# EAGLE design IDS_ADC_SMT (EAGLE 9.5.0)
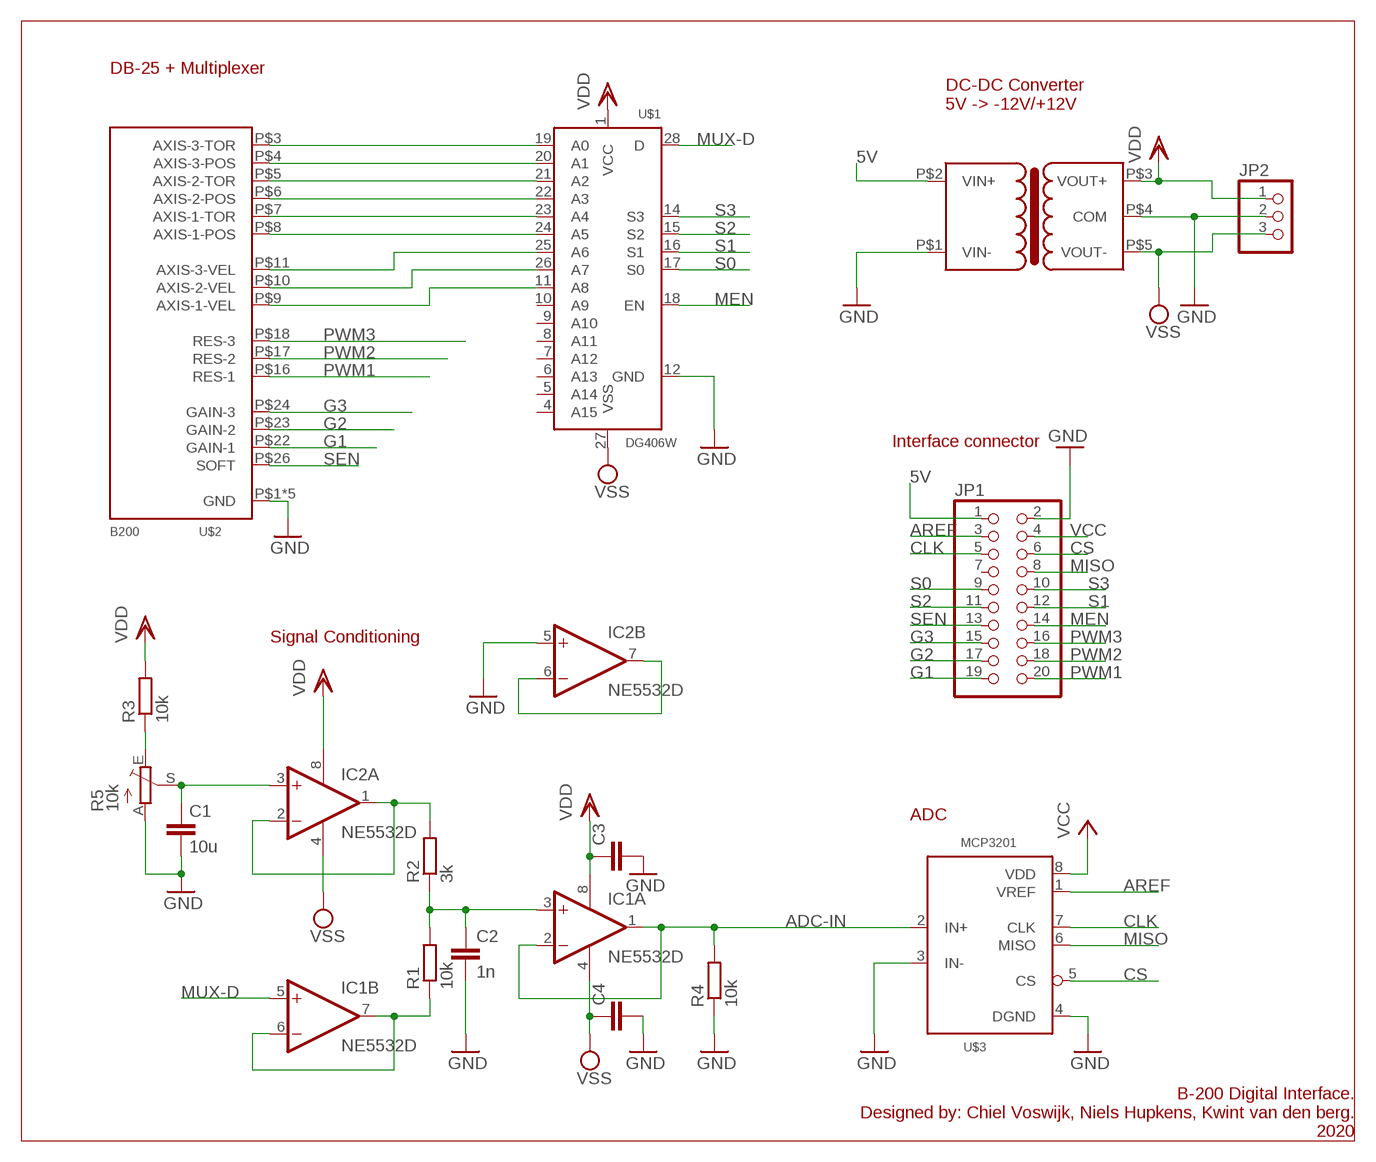
[diagram p0: schematic, sheet 1]

## Parts
C1  10u  C-EUC1210  [C1210]
C2  1n  C-EUC0805  [C0805]
C3  C-EUC0805  [C0805]
C4  C-EUC0805  [C0805]
IC1  NE5532D  [SO08]
IC2  NE5532D  [SO08]
JP1  PINHD-2X10  [2X10]
JP2  PINHD-1X3  [1X03]
R1  10k  R-EU_R0805  [R0805]
R2  3k  R-EU_R0805  [R0805]
R3  10k  R-EU_R0805  [R0805]
R4  10k  R-EU_R0805  [R0805]
R5  10k  TRIM_EU-RJ9W  [RJ9W]
U$1  DG406W  [SO-28W]
U$2  B200  [PARALLEL]
U$3  MCP3201  [DIL08]
U$4  TRACO-DR-NE  [TRACO-DCDC-SIP6]

## Nets
5V: JP1.1 U$4.P$2(VIN+)
ADC-IN: IC1.1(A:OUT) IC1.2(A:-IN) R4.2 U$3.2(IN+)
AREF: JP1.3 U$3.1(VREF)
CLK: JP1.5 U$3.7(CLK)
CS: JP1.6 U$3.5(CS)
G1: JP1.19 U$2.P$22(GAIN-1)
G2: JP1.17 U$2.P$23(GAIN-2)
G3: JP1.15 U$2.P$24(GAIN-3)
GND: C1.2 C2.2 C3.2 C4.2 IC2.5(B:+IN) JP1.2 JP2.2 R4.1 R5.A U$1.12(GND) U$2.P$1(GND) U$2.P$2(GND) U$2.P$19(GND) U$2.P$20(GND) U$2.P$21(GND) U$3.3(IN-) U$3.4(DGND) U$4.P$1(VIN-) U$4.P$4(COM)
MEN: JP1.14 U$1.18(EN)
MISO: JP1.8 U$3.6(MISO)
MUX-D: IC1.5(B:+IN) U$1.28(D)
N$1: IC2.6(B:-IN) IC2.7(B:OUT)
N$2: U$1.19(A0) U$2.P$3(AXIS-3-TOR)
N$3: C2.1 IC1.3(A:+IN) R1.2 R2.1
N$4: U$1.20(A1) U$2.P$4(AXIS-3-POS)
N$5: IC1.6(B:-IN) IC1.7(B:OUT) R1.1
N$6: U$1.21(A2) U$2.P$5(AXIS-2-TOR)
N$7: IC2.1(A:OUT) IC2.2(A:-IN) R2.2
N$8: C1.1 IC2.3(A:+IN) R5.S
N$9: U$1.22(A3) U$2.P$6(AXIS-2-POS)
N$10: U$1.23(A4) U$2.P$7(AXIS-1-TOR)
N$11: U$1.24(A5) U$2.P$8(AXIS-1-POS)
N$12: U$1.25(A6) U$2.P$11(AXIS-3-VEL)
N$13: U$1.26(A7) U$2.P$10(AXIS-2-VEL)
N$14: U$1.11(A8) U$2.P$9(AXIS-1-VEL)
N$15: R3.1 R5.E
PWM1: JP1.20 U$2.P$16(RES-1)
PWM2: JP1.18 U$2.P$17(RES-2)
PWM3: JP1.16 U$2.P$18(RES-3)
S0: JP1.9 U$1.17(S0)
S1: JP1.12 U$1.16(S1)
S2: JP1.11 U$1.15(S2)
S3: JP1.10 U$1.14(S3)
SEN: JP1.13 U$2.P$26(SOFT)
VCC: JP1.4 U$3.8(VDD)
VDD: C3.1 IC1.8(P:V+) IC2.8(P:V+) JP2.1 R3.2 U$1.1(VCC) U$4.P$3(VOUT+)
VSS: C4.1 IC1.4(P:V-) IC2.4(P:V-) JP2.3 U$1.27(VSS) U$4.P$5(VOUT-)
Unconnected: JP1.7 U$1.4(A15) U$1.5(A14) U$1.6(A13) U$1.7(A12) U$1.8(A11) U$1.9(A10) U$1.10(A9)

## Notes on the sheet
- DB-25 + Multiplexer
- DC-DC Converter
  5V -> -12V/+12V
- Interface connector
- Signal Conditioning
- ADC
- B-200 Digital Interface.
  Designed by: Chiel Voswijk, Niels Hupkens, Kwint van den berg.
  2020

## Library data of the parts
C1-C4 = rcl:C-EU: CAPACITOR, European symbol; SPICEPREFIX: C
IC1 IC2 = linear:NE5532: AUDIO AMPLIFIER
JP1 = pinhead:PINHD-2X10: PIN HEADER
JP2 = pinhead:PINHD-1X3: PIN HEADER
R1-R4 = rcl:R-EU_: RESISTOR, European symbol; SPICEPREFIX: R
R5 = pot:TRIM_EU-: POTENTIOMETER
U$1 = FHD-Actives:DG406: "Jellybean" DG406 Multiplexer
U$2 = FHD-Connectors:B200
U$3 = FHD-Actives:MCP3201
U$4 = FHD-POWER:TRACO-DR-NE

## Board
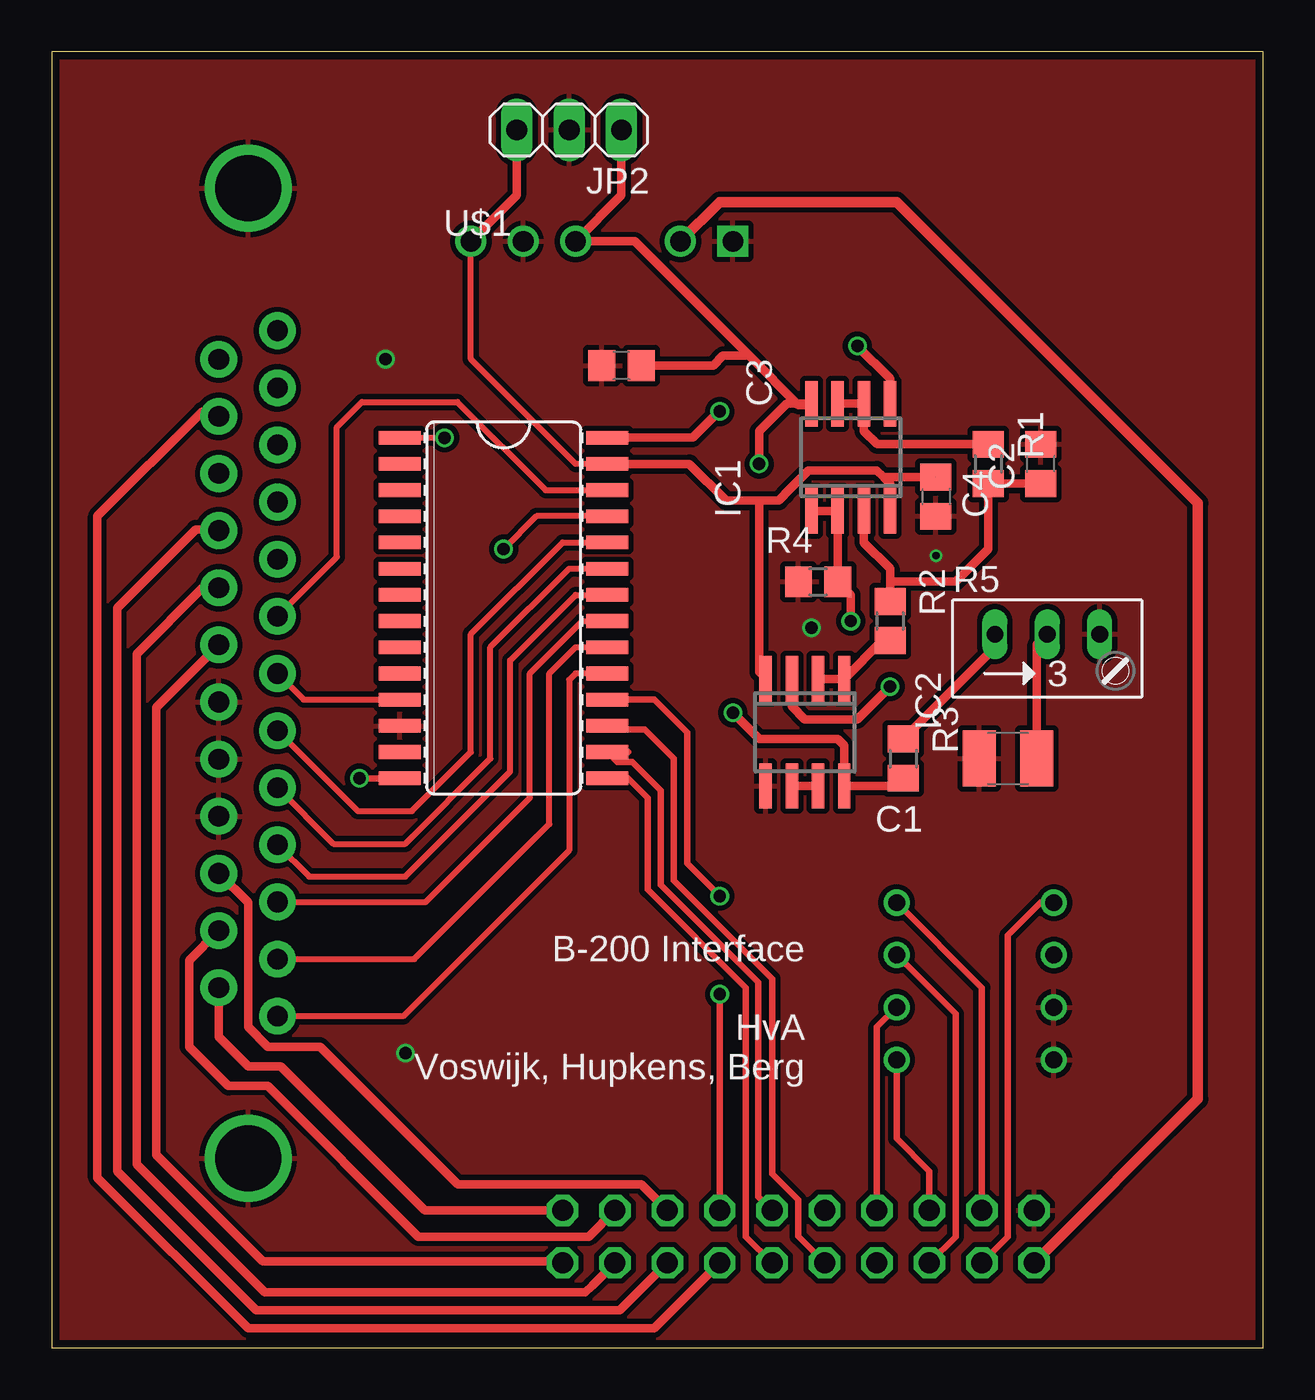
[diagram p1: board, top side]
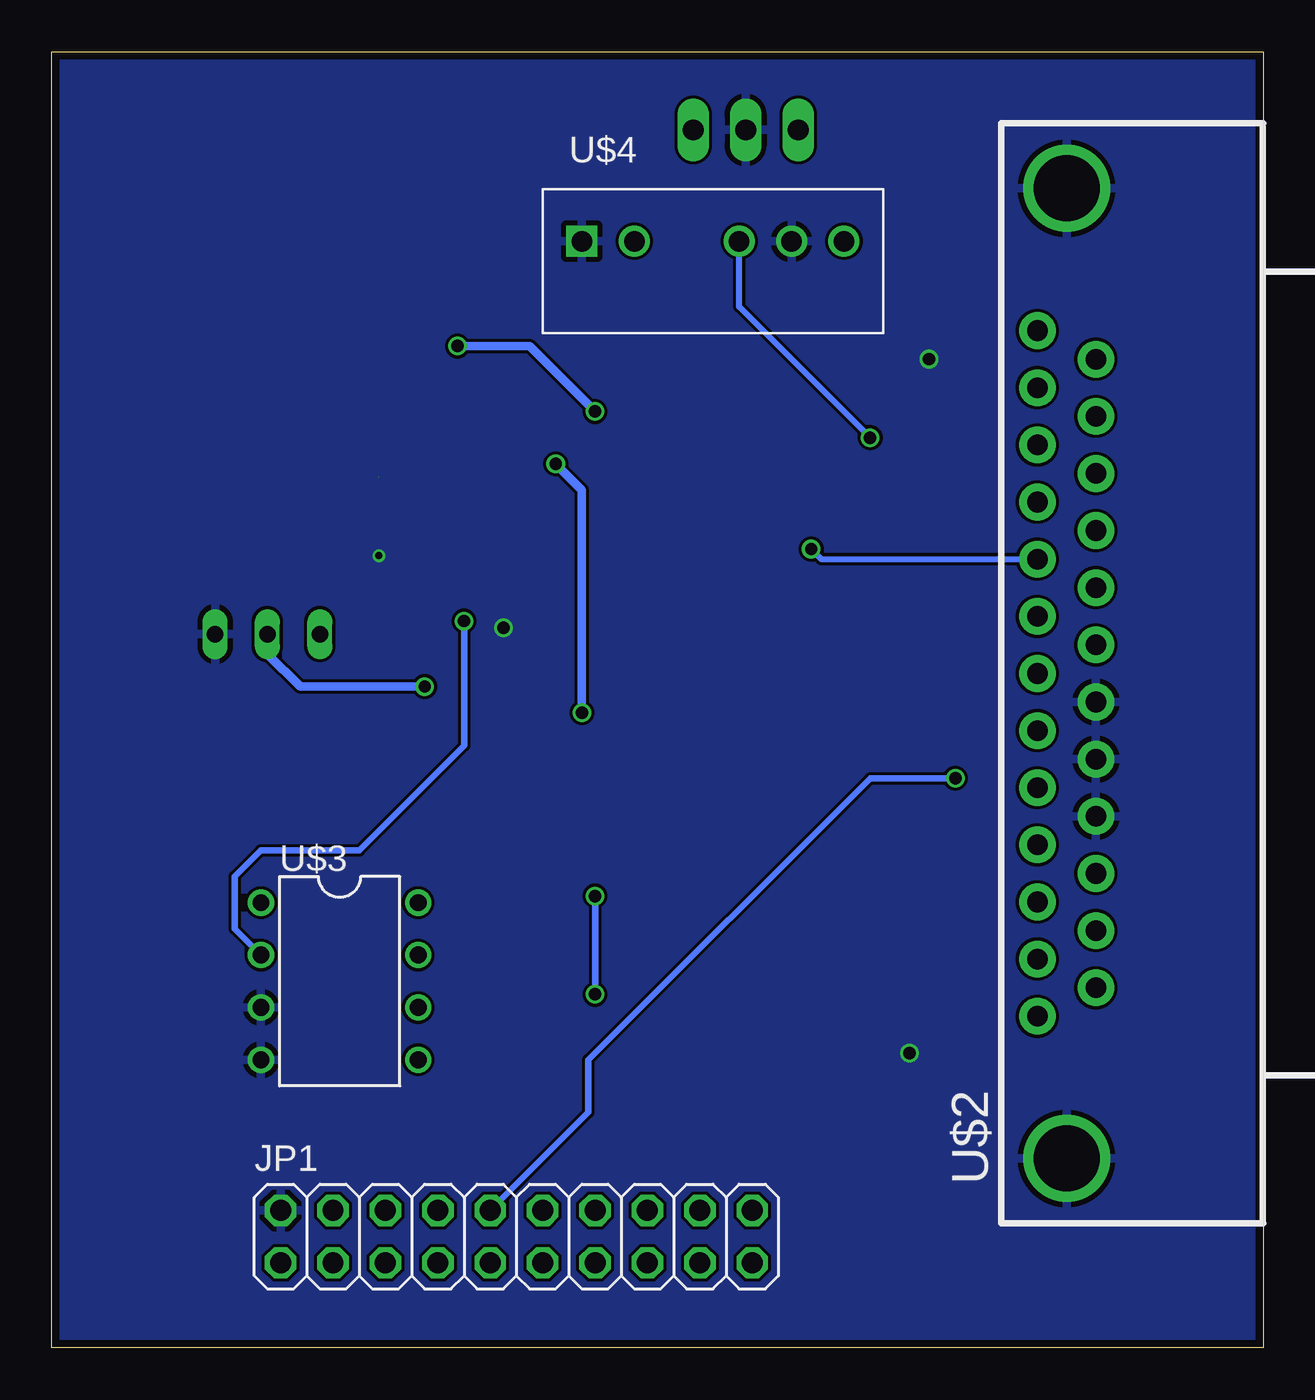
[diagram p2: board, bottom side, seen from below]

Size 58.72 x 62.85 mm. Coordinates in mm from the lower left corner, seen from the top.
Outline: 0,0 58.72,0 58.72,62.85 0,62.85 0,0
Copper layers (1*16): Top 0.035559375mm / dielectric 1.6mm / Bottom 0.035559375mm
Design rules "oshpark-2layer": minimum track width 6mil, minimum drill 10mil, track to track 6mil, track to pad 6mil, pad to pad 6mil, via to via 6mil, smd to smd 6mil, copper to edge 15mil, drill to drill 6mil, minimum pad ring 5mil, minimum via ring 5mil, stop-mask expansion 2.5mil, vias tented up to drill 0mil, thermal gap 10mil

### Footprints (pad centres in the part's own frame; a part is rotated, then mirrored left to right if it is on the bottom)
C1210 = smd 1.6 x 2.7: 1 -1.4,0; 2 1.4,0
C0805 = smd 1.3 x 1.5: 1 -0.95,0; 2 0.95,0
SO08 = smd 0.6 x 2.2: 1 -1.905,-2.6; 2 -0.635,-2.6; 3 0.635,-2.6; 4 1.905,-2.6; 5 1.905,2.6; 6 0.635,2.6; 7 -0.635,2.6; 8 -1.905,2.6
2X10 = drill 1.016 octagon: 1 -11.43,-1.27; 2 -11.43,1.27; 3 -8.89,-1.27; 4 -8.89,1.27; 5 -6.35,-1.27; 6 -6.35,1.27; 7 -3.81,-1.27; 8 -3.81,1.27; 9 -1.27,-1.27; 10 -1.27,1.27; 11 1.27,-1.27; 12 1.27,1.27; 13 3.81,-1.27; 14 3.81,1.27; 15 6.35,-1.27; 16 6.35,1.27; 17 8.89,-1.27; 18 8.89,1.27; 19 11.43,-1.27; 20 11.43,1.27
1X03 = drill 1.016 long: 1 -2.54,0; 2 0,0; 3 2.54,0
R0805 = smd 1.3 x 1.5: 1 -0.95,0; 2 0.95,0
RJ9W = drill 0.813 long: A 2.54,0.635; E -2.54,0.635; S 0,0.635
SO-28W = smd 0.66 x 2.032: 1 -8.255,-5.029; 2 -6.985,-5.029; 3 -5.715,-5.029; 4 -4.445,-5.029; 5 -3.175,-5.029; 6 -1.905,-5.029; 7 -0.635,-5.029; 8 0.635,-5.029; 9 1.905,-5.029; 10 3.175,-5.029; 11 4.445,-5.029; 12 5.715,-5.029; 13 6.985,-5.029; 14 8.255,-5.029; 15 8.255,5.029; 16 6.985,5.029; 17 5.715,5.029; 18 4.445,5.029; 19 3.175,5.029; 20 1.905,5.029; 21 0.635,5.029; 22 -0.635,5.029; 23 -1.905,5.029; 24 -3.175,5.029; 25 -4.445,5.029; 26 -5.715,5.029; 27 -6.985,5.029; 28 -8.255,5.029
PARALLEL = drill 3.2: P$1 -23.52,0; P$2 23.52,0 | drill 1 pad 1.778: P$3 -16.62,1.42; P$4 -13.85,1.42; P$5 -11.08,1.42; P$6 -8.31,1.42; P$7 -5.54,1.42; P$8 -2.77,1.42; P$9 0,1.42; P$10 2.77,1.42; P$11 5.54,1.42; P$12 8.31,1.42; P$13 11.08,1.42; P$14 13.85,1.42; P$15 16.62,1.42; P$16 -15.235,-1.42; P$17 -12.465,-1.42; P$18 -9.695,-1.42; P$19 -6.925,-1.42; P$20 -4.155,-1.42; P$21 -1.385,-1.42; P$22 1.385,-1.42; P$23 4.155,-1.42; P$24 6.925,-1.42; P$25 9.695,-1.42; P$26 12.465,-1.42; P$27 15.235,-1.42
DIL08 = drill 0.813 pad 1.27: 1 -3.81,-3.81; 2 -1.27,-3.81; 3 1.27,-3.81; 4 3.81,-3.81; 5 3.81,3.81; 6 1.27,3.81; 7 -1.27,3.81; 8 -3.81,3.81
TRACO-DCDC-SIP6 = drill 1 square: P$1 -8.89,1.27 | drill 1: P$2 -6.35,1.27; P$3 -1.27,1.27; P$4 1.27,1.27; P$5 3.81,1.27

### Placement (x,y rotation side)
C1  46.35,28.57 180 top
C2  47.94,42.86 90 top
C3  27.62,47.62 180 top
C4  42.86,41.27 270 top
IC1  38.73,43.18 0 top
IC2  36.51,29.84 180 top
JP1  36.2,5.4 0 bottom
JP2  25.08,59.05 180 top
R1  45.4,42.86 270 top
R2  40.64,35.24 270 top
R3  41.27,28.57 270 top
R4  37.15,37.15 0 top
R5  48.26,33.97 0 top
U$1  21.91,35.88 270 top
U$2  9.53,32.7 90 bottom
U$3  44.77,17.78 270 bottom
U$4  24.13,52.39 0 bottom

### Tracks (layer width: path | path; a pad name or v marks a point on that pad's centre or on a via)
5V
  Top 0.508: JP1.1 55.56,12.06 55.56,40.96 40.96,55.56 32.38,55.56 U$4.P$2
ADC-IN  (via drill 0.6)
  Top 0.406: IC1.1 IC1.2 R4.2 38.73,36.51 v38.73,35.24
  Bottom 0.305: v38.73,35.24 38.73,29.21 43.81,24.13 48.58,24.13 49.85,22.86 49.85,20.32 U$3.2
AREF
  Top 0.305: JP1.3 46.35,5.4 46.35,20 47.94,21.59 U$3.1
CLK
  Top 0.305: JP1.5 43.81,5.4 43.81,16.19 U$3.7
CS
  Top 0.305: JP1.6 42.54,8.57 40.96,10.16 U$3.5
G1
  Top 0.406: U$2.P$22 5.08,31.06 5.08,9.36 10.24,4.2 24.69,4.2 JP1.19
G2
  Top 0.406: JP1.17 26.2,3.02 26.19,3.02 25.86,2.69 10.32,2.69 4.13,8.89 4.13,33.66 7.33,36.86 U$2.P$23
G3
  Top 0.406: JP1.15 27.55,1.83 9.92,1.83 3.18,8.57 3.18,35.88 6.98,39.69 8.04,39.69 U$2.P$24
GND  (via drill 0.35, 0.6)
  other vias: 17.14,14.29 16.19,47.94 36.83,34.92 42.86,38.42
  pour Top (isolate 0.254): -3.49,0 58.74,0 58.74,65.72 -3.49,65.72
  pour Bottom: -1.27,-1.27 66.04,-1.27 66.04,64.77 -1.27,64.77
MEN  (via drill 0.6)
  Top 0.305: JP1.14 v32.38,17.14 | U$1.18 29.21,31.43 30.8,29.85 30.8,23.49 v32.38,21.91
  Bottom 0.305: v32.38,17.14 v32.38,21.91
MISO
  Top 0.305: JP1.8 40,15.56 U$3.6
MUX-D  (via drill 0.6)
  Top 0.406: U$1.28 31.06,44.13 32.33,45.4 v32.38,45.4 | v39.05,48.58 40.64,46.99 IC1.5
  Bottom 0.406: v32.38,45.4 35.56,48.58 v39.05,48.58
N$1
  Top 0.406: IC2.7 IC2.6
N$2
  Top 0.3: U$1.19 25.4,32.7 25.08,32.38 25.08,24.13 17.04,16.08 U$2.P$3
N$3
  Top 0.406: C2.1 R1.2 45.4,38.74 43.81,37.15 40.64,37.15 | IC1.3 39.37,39.05 40.64,37.78 40.64,37.15 | 40.64,37.15 R2.1
N$4
  Top 0.3: U$2.P$4 17.58,18.85 24.13,25.4 24.13,32.7 25.4,33.97 U$1.20
N$5
  Top 0.406: IC1.7 IC1.6 39.37,44.45 40.01,43.81 R1.1
N$6
  Top 0.3: U$2.P$5 18.13,21.62 23.18,26.67 23.18,32.7 25.72,35.24 U$1.21
N$7
  Top 0.406: IC2.2 IC2.1 40.27,34.29 R2.2
N$8  (via drill 0.6)
  Top 0.406: IC2.3 35.88,31.11 36.51,30.48 39.05,30.48 v40.64,32.07 | C1.1 47.75,34.1 R5.S
  Bottom 0.406: v40.64,32.07 46.67,32.07 48.26,33.66 R5.S
N$9
  Top 0.3: U$2.P$6 12.48,22.86 17.14,22.86 22.23,27.94 22.23,33.34 25.4,36.51 U$1.22
N$10
  Top 0.3: U$2.P$7 13.66,24.45 17.14,24.45 21.27,28.58 21.27,33.97 25.08,37.78 U$1.23
N$11
  Top 0.3: U$2.P$8 14.84,26.04 17.46,26.04 20.32,28.89 20.32,34.61 24.77,39.05 U$1.24
N$12  (via drill 0.6)
  Top 0.3: U$1.25 23.5,40.32 v21.91,38.74
  Bottom 0.3: v21.91,38.74 21.42,38.24 U$2.P$11
N$13
  Top 0.3: U$2.P$10 13.83,38.35 13.83,44.65 15.04,45.87 19.67,45.87 23.94,41.59 U$1.26
N$14
  Top 0.3: U$2.P$9 12.21,31.43 U$1.11
N$15
  Top 0.406: R3.1 45.72,33.97 R5.E
PWM1
  Top 0.406: U$2.P$16 8.1,15.07 9.53,13.65 11.11,13.65 18.1,6.67 JP1.20
PWM2
  Top 0.406: JP1.18 26.04,5.4 17.78,5.4 10.48,12.7 8.57,12.7 6.67,14.61 6.67,18.8 U$2.P$17
PWM3
  Top 0.406: JP1.16 28.57,7.94 19.69,7.94 13.02,14.61 10.48,14.61 9.53,15.56 9.53,21.59 U$2.P$18
S0
  Top 0.305: U$1.17 27.11,29.99 28.75,29.99 30.16,28.58 30.16,22.67 34.92,17.9 34.92,8.45 36.18,7.19 36.18,5.41 JP1.9
S1
  Top 0.305: 27.94,28.89 U$1.16 27.42,28.41 28.14,28.41 29.53,27.02 29.53,22.45 34.26,17.71 34.26,7.33 JP1.12
S2
  Top 0.305: JP1.11 33.66,5.4 33.66,17.46 28.89,22.22 28.89,26.67 27.94,27.62 U$1.15
S3  (via drill 0.6)
  Top 0.305: v14.92,27.62 U$1.14
  Bottom 0.305: JP1.10 32.7,11.43 32.7,13.97 19.05,27.62 v14.92,27.62
SEN
  Top 0.406: JP1.13 29.21,0.95 9.53,0.95 2.22,8.26 2.22,40.32 7.3,45.4 7.87,45.4 U$2.P$26
VCC
  Top 0.305: JP1.4 45.09,17.46 U$3.8
VDD  (via drill 0.6)
  Top 0.3: U$1.1 v19.05,44.13
  Top 0.406: JP2.1 27.62,55.88 U$4.P$3 28.26,53.66 33.81,48.1 | 33.81,48.1 36.2,45.72 36.77,45.72 IC1.8 35.62,45.78 34.29,44.45 v34.29,42.86 | v33.02,30.8 34.29,29.53 38.1,29.53 38.42,29.21 IC2.8 40.89,27.24 R3.2 | C3.1 32.06,47.63 32.54,48.1 33.81,48.1
  Bottom 0.3: v19.05,44.13 25.4,50.48 U$4.P$3
  Bottom 0.406: v33.02,30.8 33.02,41.59 v34.29,42.86
VSS  (1 unrouted)
  Top 0.3: U$1.27 25.4,42.86 20.32,47.94 U$4.P$5
  Top 0.406: JP2.3 22.54,55.88 U$4.P$5 | 34.29,41.08 33.97,41.08 32.7,41.08 30.91,42.86 U$1.27 | 34.29,41.08 35.25,41.08 35.54,41.37 35.54,41.4 36.68,42.55 40,42.55 40.32,42.23 | 40.32,42.23 40.64,41.91 IC1.4 | C4.1 40.32,42.23 | IC2.4 34.29,32.76 34.29,41.08 | 34.29,41.08

### Text on the board
tNames: B-200 Interface / / HvA / Voswijk, Hupkens, Berg